# Altium schematic sheet SCH_Mobile-robot.schdoc
size 254 x 221 mm
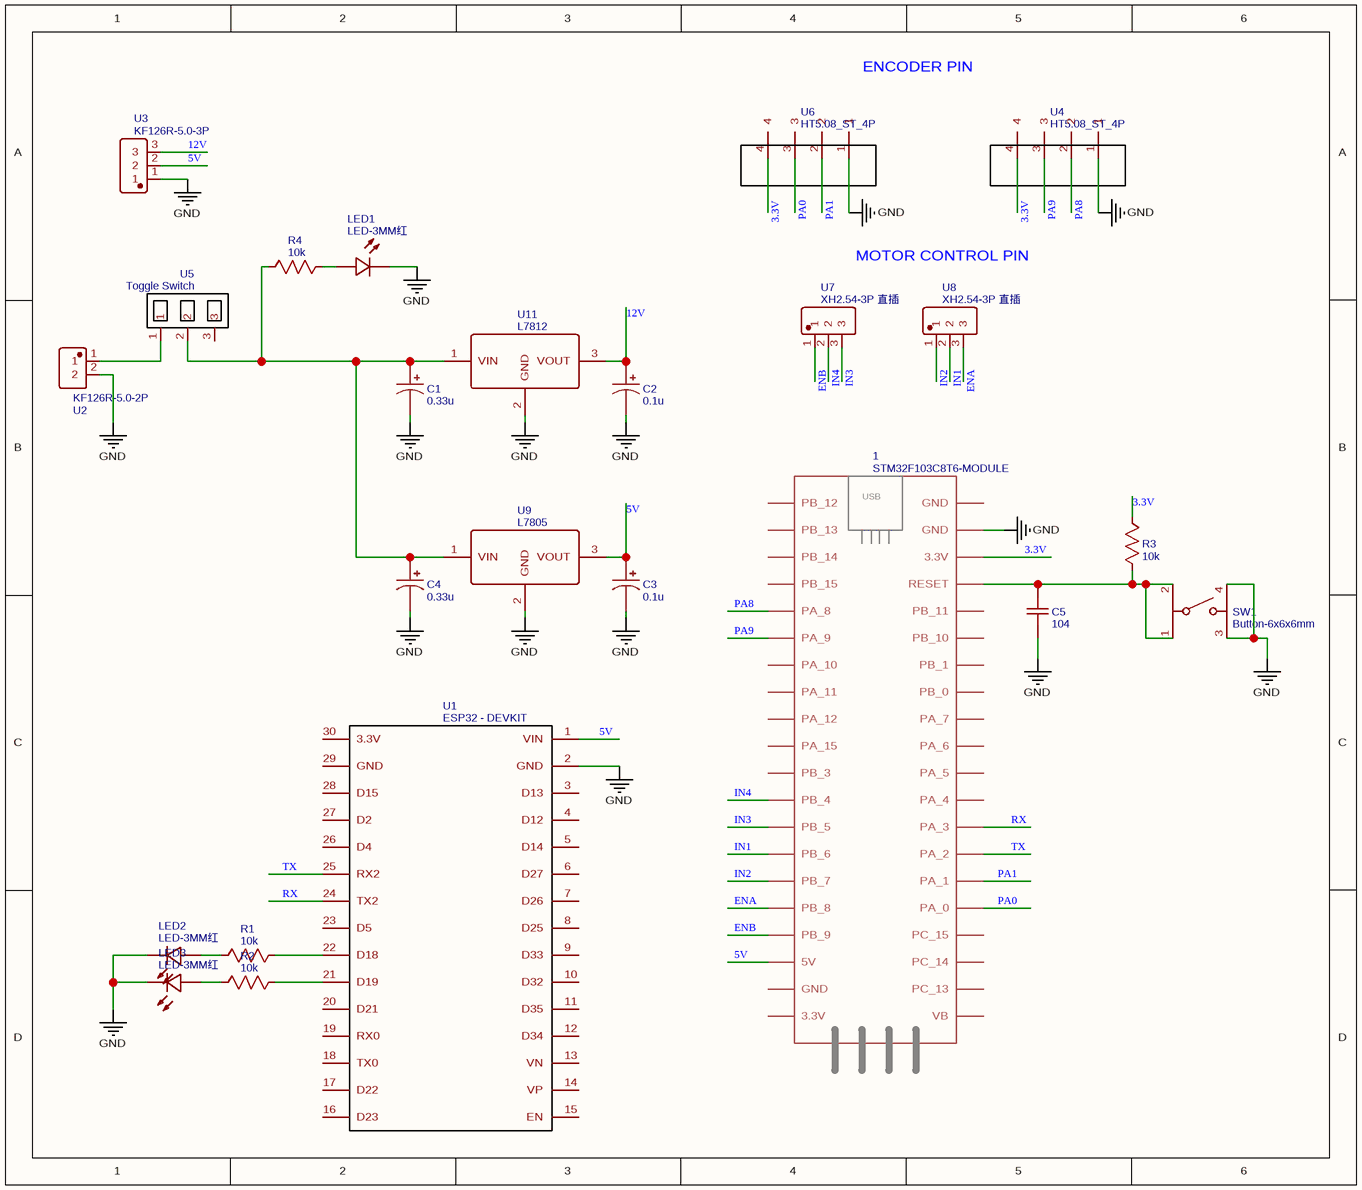
[diagram p0: SCH_Mobile-robot.schdoc]

## Parts
1  STM32F103C8T6-MODULE  [STM32F103C8T6-MODULE]
C1  0.33u  [CAP-GT-6.3*11]
C2  0.1u  [CAP-GT-6.3*11]
C3  0.1u  [CAP-GT-6.3*11]
C4  0.33u  [CAP-GT-6.3*11]
C5  104  [47NF]
LED1  LED-3MM红  [LED_D3.0MM]
LED2  LED-3MM红  [LED_D3.0MM]
LED3  LED-3MM红  [LED_D3.0MM]
R1  10k  [RESISTOR-1/4W - 2]
R2  10k  [RESISTOR-1/4W - 2]
R3  10k  [RESISTOR-1/4W - 2]
R4  10k  [RESISTOR-1/4W - 2]
SW1  Button-6x6x6mm  [SW-TH_4P-L6.0-W6.0-P4.50-LS6.1]
U1  ESP32 - DEVKIT  [ESP32 - DEVKIT]
U2  KF126R-5.0-2P  [CONN-TH_P5.00_KF126R-5.0-2P]
U3  KF126R-5.0-3P  [CONN-TH_3P-P5.00_KF126R-5.0-3P]
U4  HT5.08_ST_4P  [HT5.08_ST_4P]
U5  Toggle Switch  [TOGGLESWITCH2]
U6  HT5.08_ST_4P  [HT5.08_ST_4P]
U7  XH2.54-3P 直插  [CONN-TH_XH2.54-3P]
U8  XH2.54-3P 直插  [CONN-TH_XH2.54-3P]
U9  L7805  [TO-220-3_L10.0-W4.5-P2.54-L]
U11  L7812  [TO-220-3_L10.0-W4.5-P2.54-L]

## Nets
GND: 1.GND_2(GND) C1.2 C2.2 C3.2 C4.2 C5.1 LED1.2 LED2.2 LED3.2 SW1.3 SW1.4 U1.2(GND) U2.2 U3.1 U4.1 U6.1 U9.2(GND) U11.2(GND)
3.3V: 1.3.3V_2(3.3V) R3.1 U4.4 U6.4
5V: 1.5V C3.1 U1.1(VIN) U3.2 U9.3(VOUT)
12V: C2.1 U3.3 U11.3(VOUT)
ENA: 1.PB_8 U8.3
ENB: 1.PB_9 U7.1
IN1: 1.PB_6 U8.2
IN2: 1.PB_7 U8.1
IN3: 1.PB_5 U7.3
IN4: 1.PB_4 U7.2
PA0: 1.PA_0 U6.3
PA1: 1.PA_1 U6.2
PA8: 1.PA_8 U4.2
PA9: 1.PA_9 U4.3
RX: 1.PA_3 U1.24(TX2)
TX: 1.PA_2 U1.25(RX2)
Net1_RESET: 1.RESET C5.2 R3.2 SW1.1 SW1.2
NetC1_1: C1.1 C4.1 R4.2 U5.2 U9.1(VIN) U11.1(VIN)
NetLED1_1: LED1.1 R4.1
NetLED2_1: LED2.1 R1.2
NetLED3_1: LED3.1 R2.2
NetR1_1: R1.1 U1.22(D18)
NetR2_1: R2.1 U1.21(D19)
NetU2_1: U2.1 U5.1

Not connected (* = marked no-connect by the designer): 1 3.3V_1(3.3V) GND_1(GND) GND_3(GND) PA_4 PA_5 PA_6 PA_7 PA_10 PA_11 PA_12 PA_15 PB_0 PB_1 PB_3 PB_10 PB_11 PB_12 PB_13 PB_14 PB_15 PC_13 PC_14 PC_15 VB; U1 3(D13) 4(D12) 5(D14) 6(D27) 7(D26) 8(D25) 9(D33) 10(D32) 11(D35) 12(D34) 13(VN) 14(VP) 15(EN) 16(D23) 17(D22) 18(TX0) 19(RX0) 20(D21) 23(D5) 26(D4) 27(D2) 28(D15) 29(GND) 30(3.3V); U5 3

## Notes on the sheet
- ENCODER PIN
- MOTOR CONTROL PIN
- (in symbol STM32F103C8T6-MODULE) USB

## Library data of the parts
1 = STM32F103C8T6-MODULE: Contributor: minhnhathust2002; spicePre: ?; spiceSymbolName: STM32F103C8T6-MODULE
C1 C4 = 0.33u: nameAlias: Value(F); Contributor: LCEDA_Lib; spicePre: C; spiceSymbolName: CE_TH_D3.0×F1.5_US
C2 C3 = 0.1u: nameAlias: Value(F); Contributor: LCEDA_Lib; spicePre: C; spiceSymbolName: CE_TH_D3.0×F1.5_US
C5 = 104: nameAlias: Value(F); Contributor: LCEDA_Lib; spicePre: C; spiceSymbolName: C_0603_US
LED1-LED3 = LED-3MM红: Contributor: LCSC; Supplier: LCSC; Supplier Part: C9900003389; Manufacturer Part: LED-3mm红; JLCPCB Part Class: Extended Part; link: https://lcsc.com/eda_search?q=C9900003389&%26type=1&ref=editor; spicePre: L; spiceSymbolName: LED-3MM红
R1-R4 = 10k: nameAlias: Value(Ω); Contributor: LCEDA_Lib; Package Display: No; spicePre: R; spiceSymbolName: R_0603_US
SW1 = Button-6x6x6mm: Manufacturer: BBJ; Manufacturer Part: Switch,6*6*6Plastic head,260G, 0.25mm,Straight line; Supplier Part: C71836; Supplier: LCSC; link: https://lcsc.com/eda_search?q=C71836&%26type=1&ref=editor; spicePre: S; spiceSymbolName: Button-6x6x6mm
U1 = ESP32 - DEVKIT: Contributor: minhnhathust2002; spicePre: U; spiceSymbolName: ESP32 - DEVKIT
U2 = KF126R-5.0-2P: Manufacturer: KEFA(科发); Contributor: LCSC; Supplier: LCSC; Supplier Part: C474902; Manufacturer Part: KF126R-5.0-2P; JLCPCB Part Class: Extended Part; link: https://lcsc.com/eda_search?q=C474902&%26type=1&ref=editor; spicePre: U; spiceSymbolName: KF126R-5.0-2P
U3 = KF126R-5.0-3P: Manufacturer: KEFA(科发); Contributor: LCSC; Supplier: LCSC; Supplier Part: C474903; Manufacturer Part: KF126R-5.0-3P; JLCPCB Part Class: Extended Part; link: https://lcsc.com/eda_search?q=C474903&%26type=1&ref=editor; spicePre: U; spiceSymbolName: KF126R-5.0-3P
U4 U6 = HT5.08_ST_4P: Contributor: thomas720; spicePre: U; spiceSymbolName: HT5.08_ST_4P
U5 = Toggle Switch: Contributor: minhnhathust2002; spicePre: U; spiceSymbolName: Toggle Switch
U7 U8 = XH2.54-3P 直插: Manufacturer: null; Contributor: LCSC; Supplier: LCSC; Supplier Part: C9900000727; Manufacturer Part: XH2.54-3P 直插; JLCPCB Part Class: Extended Part; link: https://lcsc.com/eda_search?q=C9900000727&%26type=1&ref=editor; spicePre: U; spiceSymbolName: XH2.54-3P 直插
U9 = L7805: Manufacturer: FeiHong(飞虹); Manufacturer Part: KA7812B; Contributor: LCSC; Supplier: LCSC; Supplier Part: C438618; JLCPCB Part Class: Extended Part; link: https://lcsc.com/eda_search?q=C438618&%26type=1&ref=editor; spicePre: U; spiceSymbolName: KA7812B
U11 = L7812: Manufacturer: FeiHong(飞虹); Manufacturer Part: KA7812B; Contributor: LCSC; Supplier: LCSC; Supplier Part: C438618; JLCPCB Part Class: Extended Part; link: https://lcsc.com/eda_search?q=C438618&%26type=1&ref=editor; spicePre: U; spiceSymbolName: KA7812B